# EAGLE schematic ECU_JUMPER (EAGLE 9.1.3)
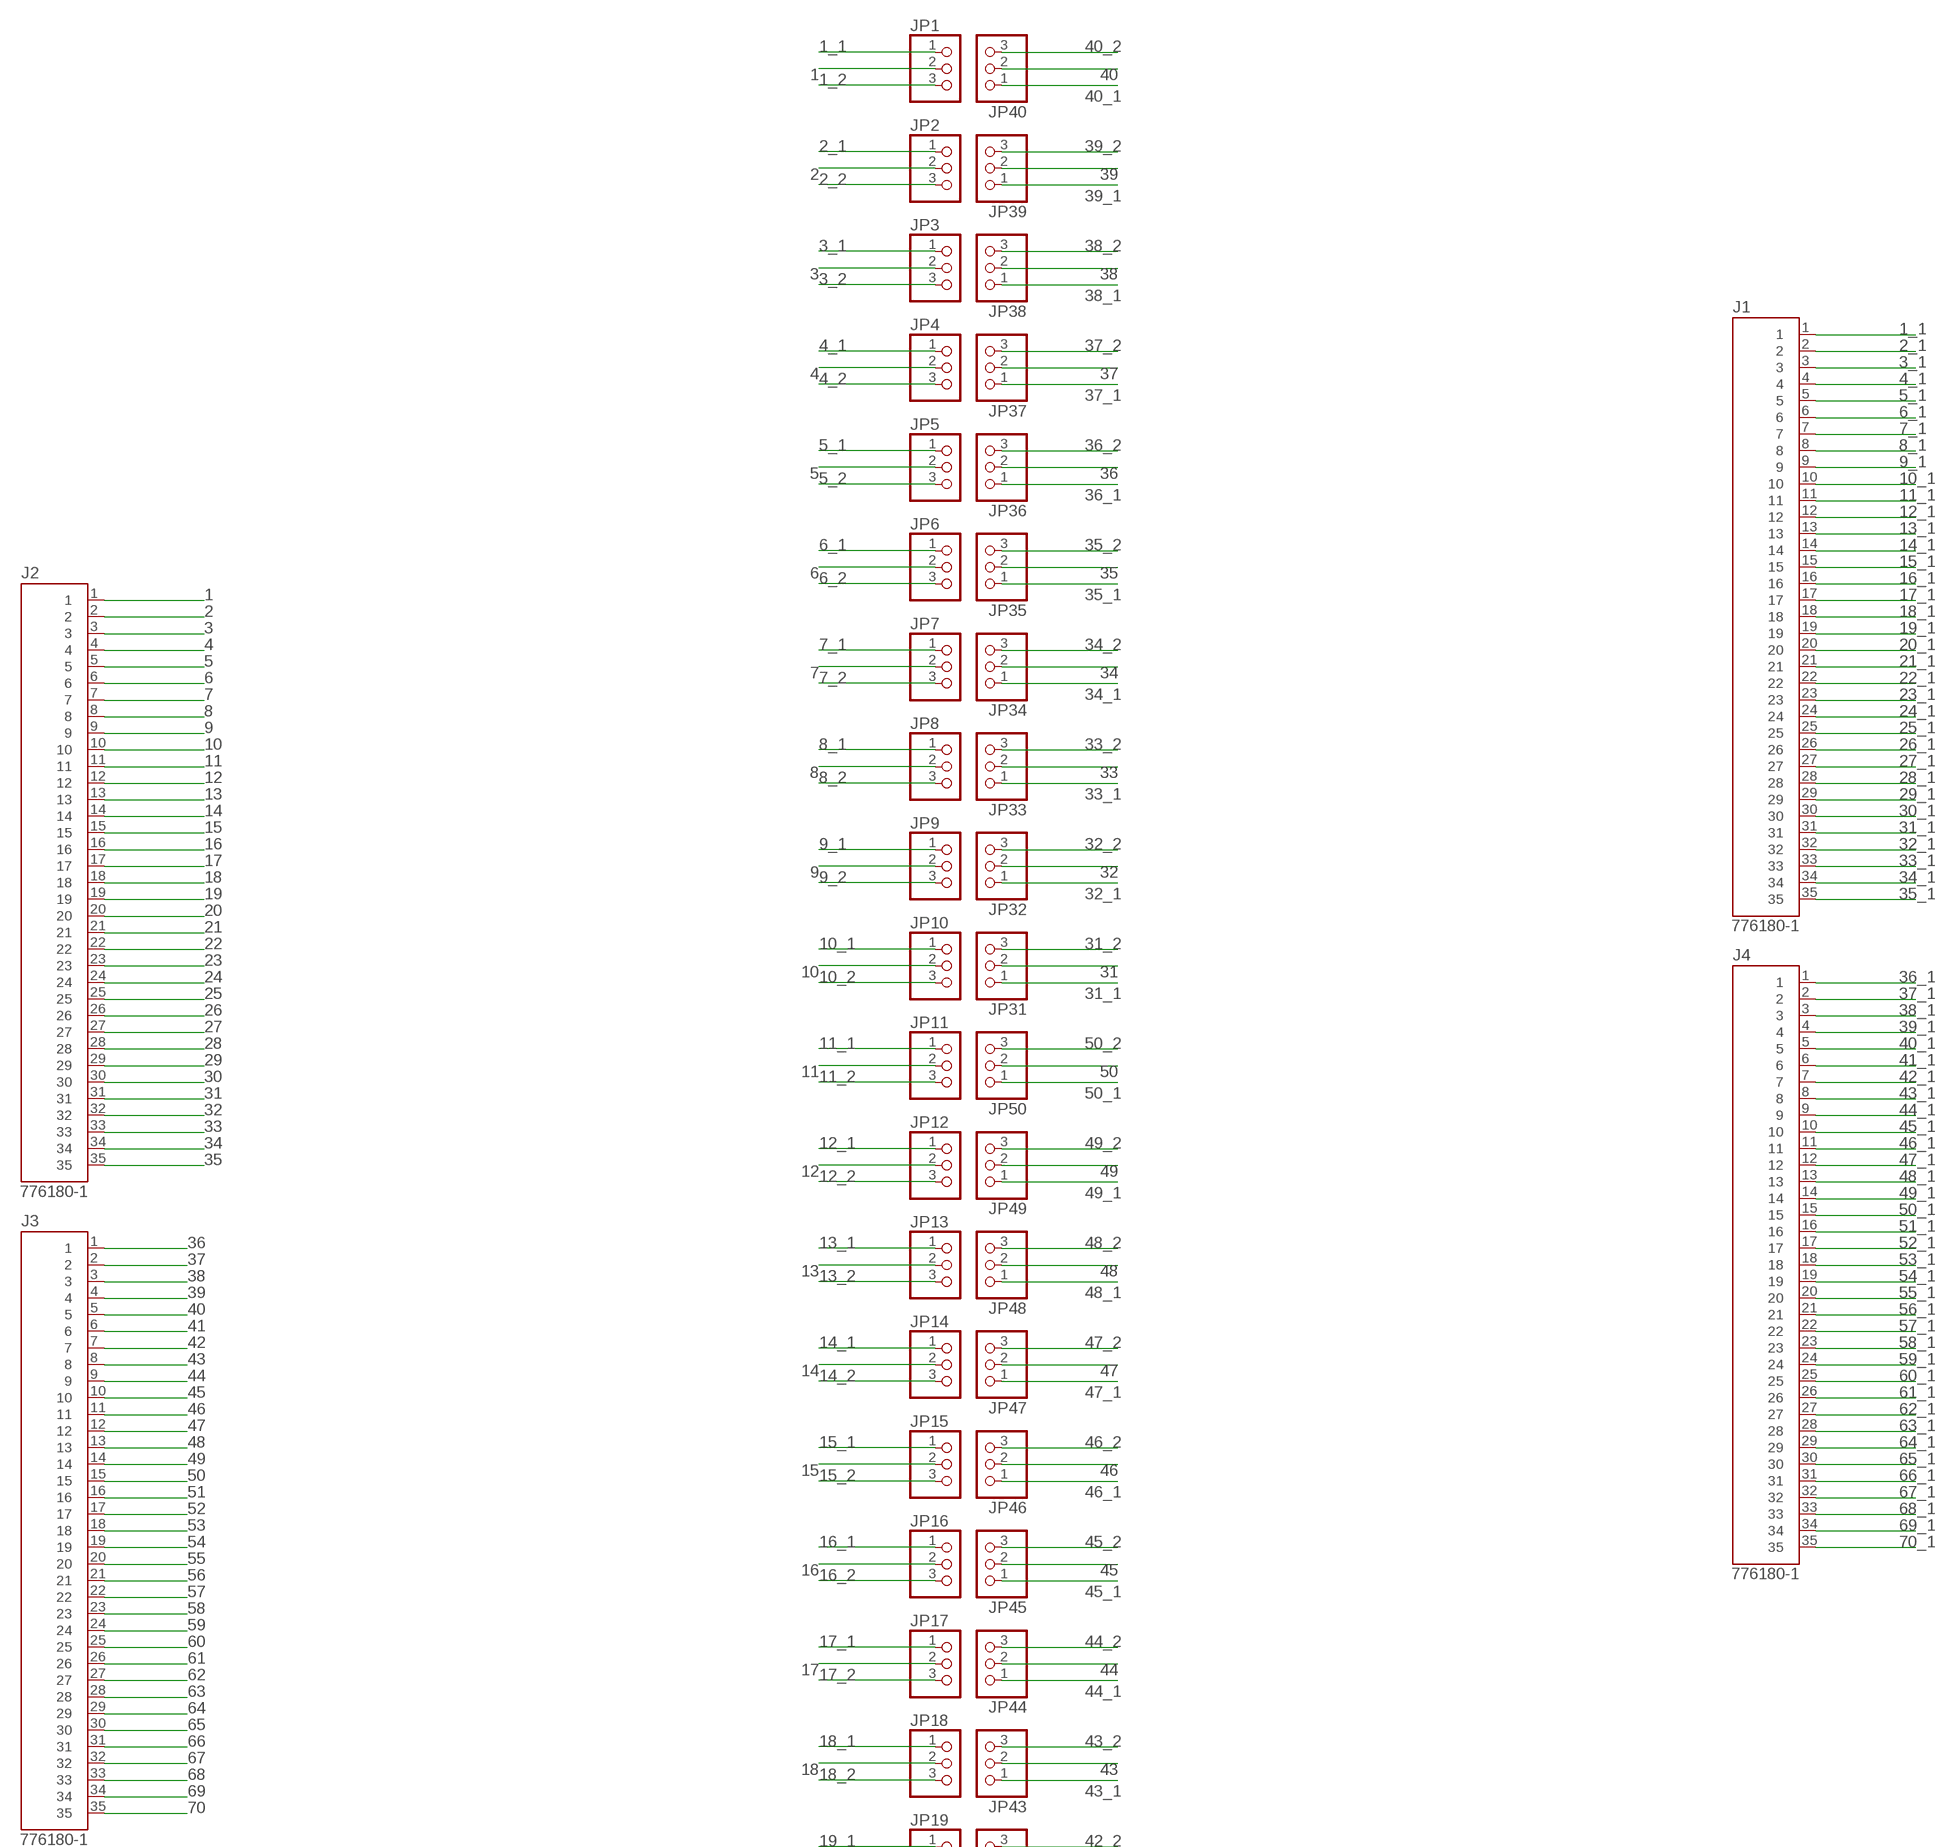
[diagram p0: schematic, sheet 1, part 1 of 2]
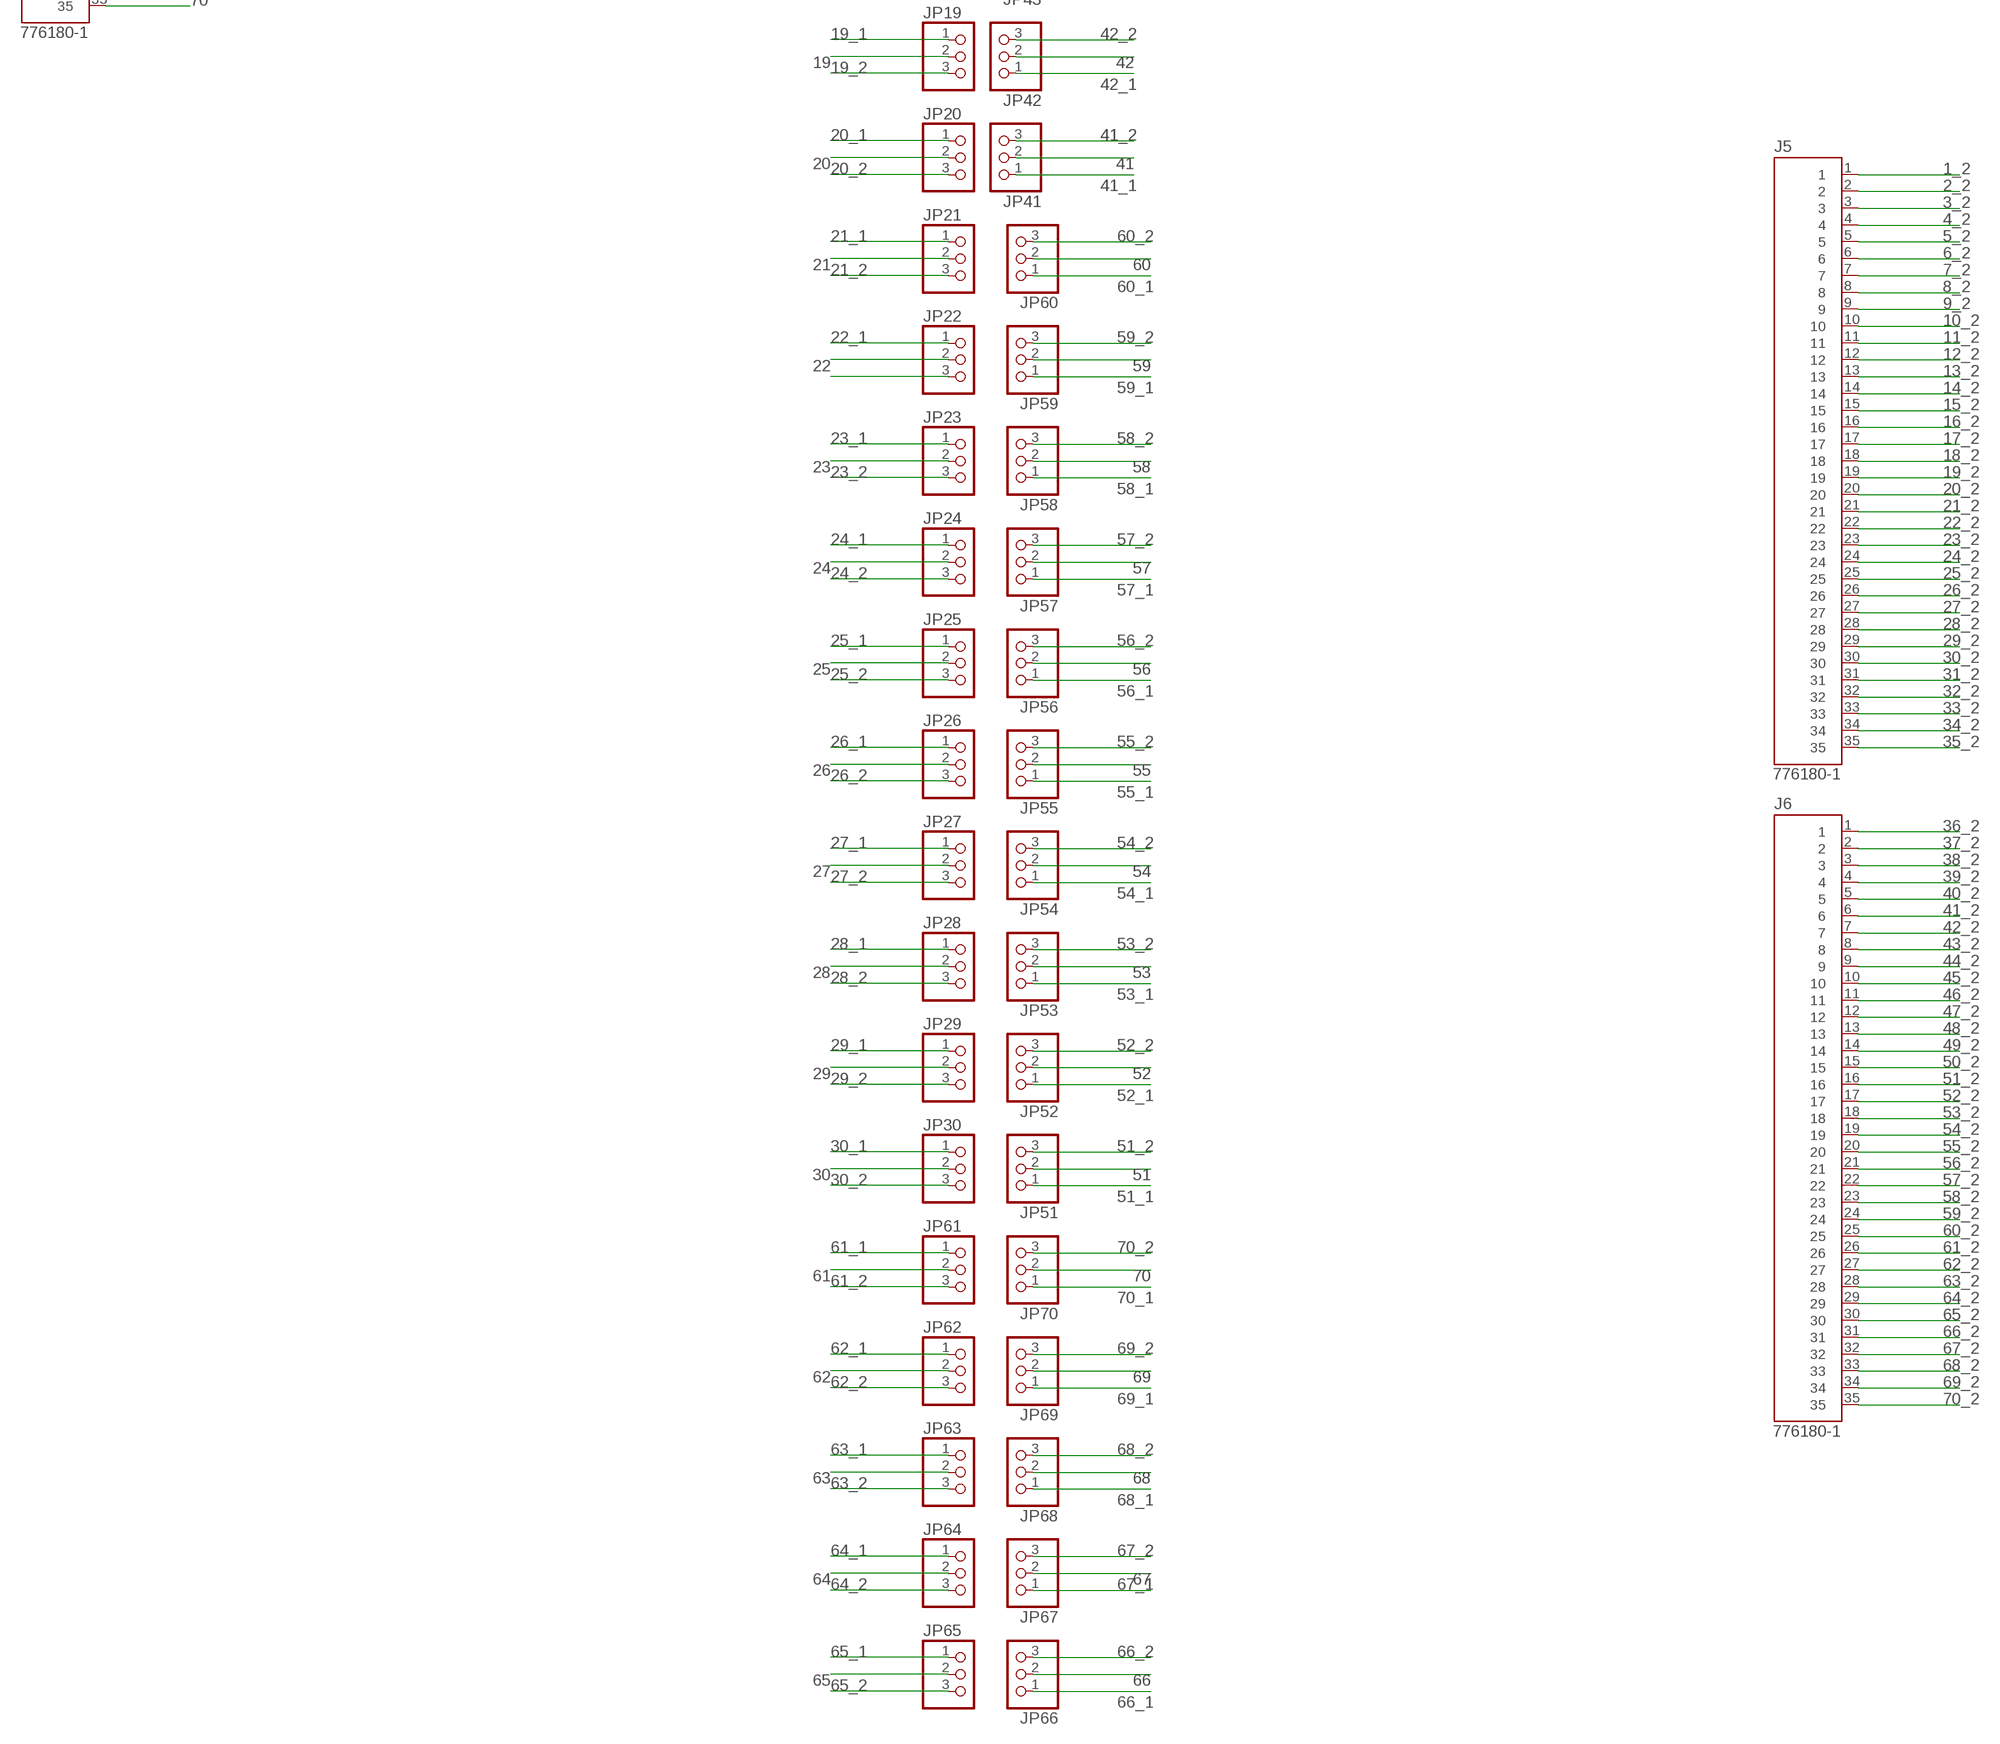
[diagram p1: schematic, sheet 1, part 2 of 2]

## Parts
J1  776180-1  [TE_776180-1]
J2  776180-1  [TE_776180-1]
J3  776180-1  [TE_776180-1]
J4  776180-1  [TE_776180-1]
J5  776180-1  [TE_776180-1]
J6  776180-1  [TE_776180-1]
JP1  PINHD-1X3  [1X03]
JP2  PINHD-1X3  [1X03]
JP3  PINHD-1X3  [1X03]
JP4  PINHD-1X3  [1X03]
JP5  PINHD-1X3  [1X03]
JP6  PINHD-1X3  [1X03]
JP7  PINHD-1X3  [1X03]
JP8  PINHD-1X3  [1X03]
JP9  PINHD-1X3  [1X03]
JP10  PINHD-1X3  [1X03]
JP11  PINHD-1X3  [1X03]
JP12  PINHD-1X3  [1X03]
JP13  PINHD-1X3  [1X03]
JP14  PINHD-1X3  [1X03]
JP15  PINHD-1X3  [1X03]
JP16  PINHD-1X3  [1X03]
JP17  PINHD-1X3  [1X03]
JP18  PINHD-1X3  [1X03]
JP19  PINHD-1X3  [1X03]
JP20  PINHD-1X3  [1X03]
JP21  PINHD-1X3  [1X03]
JP22  PINHD-1X3  [1X03]
JP23  PINHD-1X3  [1X03]
JP24  PINHD-1X3  [1X03]
JP25  PINHD-1X3  [1X03]
JP26  PINHD-1X3  [1X03]
JP27  PINHD-1X3  [1X03]
JP28  PINHD-1X3  [1X03]
JP29  PINHD-1X3  [1X03]
JP30  PINHD-1X3  [1X03]
JP31  PINHD-1X3  [1X03]
JP32  PINHD-1X3  [1X03]
JP33  PINHD-1X3  [1X03]
JP34  PINHD-1X3  [1X03]
JP35  PINHD-1X3  [1X03]
JP36  PINHD-1X3  [1X03]
JP37  PINHD-1X3  [1X03]
JP38  PINHD-1X3  [1X03]
JP39  PINHD-1X3  [1X03]
JP40  PINHD-1X3  [1X03]
JP41  PINHD-1X3  [1X03]
JP42  PINHD-1X3  [1X03]
JP43  PINHD-1X3  [1X03]
JP44  PINHD-1X3  [1X03]
JP45  PINHD-1X3  [1X03]
JP46  PINHD-1X3  [1X03]
JP47  PINHD-1X3  [1X03]
JP48  PINHD-1X3  [1X03]
JP49  PINHD-1X3  [1X03]
JP50  PINHD-1X3  [1X03]
JP51  PINHD-1X3  [1X03]
JP52  PINHD-1X3  [1X03]
JP53  PINHD-1X3  [1X03]
JP54  PINHD-1X3  [1X03]
JP55  PINHD-1X3  [1X03]
JP56  PINHD-1X3  [1X03]
JP57  PINHD-1X3  [1X03]
JP58  PINHD-1X3  [1X03]
JP59  PINHD-1X3  [1X03]
JP60  PINHD-1X3  [1X03]
JP61  PINHD-1X3  [1X03]
JP62  PINHD-1X3  [1X03]
JP63  PINHD-1X3  [1X03]
JP64  PINHD-1X3  [1X03]
JP65  PINHD-1X3  [1X03]
JP66  PINHD-1X3  [1X03]
JP67  PINHD-1X3  [1X03]
JP68  PINHD-1X3  [1X03]
JP69  PINHD-1X3  [1X03]
JP70  PINHD-1X3  [1X03]

## Nets
1: J2.1 JP1.2
1_1: J1.1 JP1.1
1_2: J5.1 JP1.3
2: J2.2 JP2.2
2_1: J1.2 JP2.1
2_2: J5.2 JP2.3
3: J2.3 JP3.2
3_1: J1.3 JP3.1
3_2: J5.3 JP3.3
4: J2.4 JP4.2
4_1: J1.4 JP4.1
4_2: J5.4 JP4.3
5: J2.5 JP5.2
5_1: J1.5 JP5.1
5_2: J5.5 JP5.3
6: J2.6 JP6.2
6_1: J1.6 JP6.1
6_2: J5.6 JP6.3
7: J2.7 JP7.2
7_1: J1.7 JP7.1
7_2: J5.7 JP7.3
8: J2.8 JP8.2
8_1: J1.8 JP8.1
8_2: J5.8 JP8.3
9: J2.9 JP9.2
9_1: J1.9 JP9.1
9_2: J5.9 JP9.3
10: J2.10 JP10.2
10_1: J1.10 JP10.1
10_2: J5.10 JP10.3
11: J2.11 JP11.2
11_1: J1.11 JP11.1
11_2: J5.11 JP11.3
12: J2.12 JP12.2
12_1: J1.12 JP12.1
12_2: J5.12 JP12.3
13: J2.13 JP13.2
13_1: J1.13 JP13.1
13_2: J5.13 JP13.3
14: J2.14 JP14.2
14_1: J1.14 JP14.1
14_2: J5.14 JP14.3
15: J2.15 JP15.2
15_1: J1.15 JP15.1
15_2: J5.15 JP15.3
16: J2.16 JP16.2
16_1: J1.16 JP16.1
16_2: J5.16 JP16.3
17: J2.17 JP17.2
17_1: J1.17 JP17.1
17_2: J5.17 JP17.3
18: J2.18 JP18.2
18_1: J1.18 JP18.1
18_2: J5.18 JP18.3
19: J2.19 JP19.2
19_1: J1.19 JP19.1
19_2: J5.19 JP19.3
20: J2.20 JP20.2
20_1: J1.20 JP20.1
20_2: J5.20 JP20.3
21: J2.21 JP21.2
21_1: J1.21 JP21.1
21_2: J5.21 JP21.3
22: J2.22 JP22.2
22_1: J1.22 JP22.1
22_2: J5.22
23: J2.23 JP23.2
23_1: J1.23 JP23.1
23_2: J5.23 JP23.3
24: J2.24 JP24.2
24_1: J1.24 JP24.1
24_2: J5.24 JP24.3
25: J2.25 JP25.2
25_1: J1.25 JP25.1
25_2: J5.25 JP25.3
26: J2.26 JP26.2
26_1: J1.26 JP26.1
26_2: J5.26 JP26.3
27: J2.27 JP27.2
27_1: J1.27 JP27.1
27_2: J5.27 JP27.3
28: J2.28 JP28.2
28_1: J1.28 JP28.1
28_2: J5.28 JP28.3
29: J2.29 JP29.2
29_1: J1.29 JP29.1
29_2: J5.29 JP29.3
30: J2.30 JP30.2
30_1: J1.30 JP30.1
30_2: J5.30 JP30.3
31: J2.31 JP31.2
31_1: J1.31 JP31.1
31_2: J5.31 JP31.3
32: J2.32 JP32.2
32_1: J1.32 JP32.1
32_2: J5.32 JP32.3
33: J2.33 JP33.2
33_1: J1.33 JP33.1
33_2: J5.33 JP33.3
34: J2.34 JP34.2
34_1: J1.34 JP34.1
34_2: J5.34 JP34.3
35: J2.35 JP35.2
35_1: J1.35 JP35.1
35_2: J5.35 JP35.3
36: J3.1 JP36.2
36_1: J4.1 JP36.1
36_2: J6.1 JP36.3
37: J3.2 JP37.2
37_1: J4.2 JP37.1
37_2: J6.2 JP37.3
38: J3.3 JP38.2
38_1: J4.3 JP38.1
38_2: J6.3 JP38.3
39: J3.4 JP39.2
39_1: J4.4 JP39.1
39_2: J6.4 JP39.3
40: J3.5 JP40.2
40_1: J4.5 JP40.1
40_2: J6.5 JP40.3
41: J3.6 JP41.2
41_1: J4.6 JP41.1
41_2: J6.6 JP41.3
42: J3.7 JP42.2
42_1: J4.7 JP42.1
42_2: J6.7 JP42.3
43: J3.8 JP43.2
43_1: J4.8 JP43.1
43_2: J6.8 JP43.3
44: J3.9 JP44.2
44_1: J4.9 JP44.1
44_2: J6.9 JP44.3
45: J3.10 JP45.2
45_1: J4.10 JP45.1
45_2: J6.10 JP45.3
46: J3.11 JP46.2
46_1: J4.11 JP46.1
46_2: J6.11 JP46.3
47: J3.12 JP47.2
47_1: J4.12 JP47.1
47_2: J6.12 JP47.3
48: J3.13 JP48.2
48_1: J4.13 JP48.1
48_2: J6.13 JP48.3
49: J3.14 JP49.2
49_1: J4.14 JP49.1
49_2: J6.14 JP49.3
50: J3.15 JP50.2
50_1: J4.15 JP50.1
50_2: J6.15 JP50.3
51: J3.16 JP51.2
51_1: J4.16 JP51.1
51_2: J6.16 JP51.3
52: J3.17 JP52.2
52_1: J4.17 JP52.1
52_2: J6.17 JP52.3
53: J3.18 JP53.2
53_1: J4.18 JP53.1
53_2: J6.18 JP53.3
54: J3.19 JP54.2
54_1: J4.19 JP54.1
54_2: J6.19 JP54.3
55: J3.20 JP55.2
55_1: J4.20 JP55.1
55_2: J6.20 JP55.3
56: J3.21 JP56.2
56_1: J4.21 JP56.1
56_2: J6.21 JP56.3
57: J3.22 JP57.2
57_1: J4.22 JP57.1
57_2: J6.22 JP57.3
58: J3.23 JP58.2
58_1: J4.23 JP58.1
58_2: J6.23 JP58.3
59: J3.24 JP59.2
59_1: J4.24 JP59.1
59_2: J6.24 JP59.3
60: J3.25 JP60.2
60_1: J4.25 JP60.1
60_2: J6.25 JP60.3
61: J3.26 JP61.2
61_1: J4.26 JP61.1
61_2: J6.26 JP61.3
62: J3.27 JP62.2
62_1: J4.27 JP62.1
62_2: J6.27 JP62.3
63: J3.28 JP63.2
63_1: J4.28 JP63.1
63_2: J6.28 JP63.3
64: J3.29 JP64.2
64_1: J4.29 JP64.1
64_2: J6.29 JP64.3
65: J3.30 JP65.2
65_1: J4.30 JP65.1
65_2: J6.30 JP65.3
66: J3.31 JP66.2
66_1: J4.31 JP66.1
66_2: J6.31 JP66.3
67: J3.32 JP67.2
67_1: J4.32 JP67.1
67_2: J6.32 JP67.3
68: J3.33 JP68.2
68_1: J4.33 JP68.1
68_2: J6.33 JP68.3
69: J3.34 JP69.2
69_1: J4.34 JP69.1
69_2: J6.34 JP69.3
70: J3.35 JP70.2
70_1: J4.35 JP70.1
70_2: J6.35 JP70.3
N$66: JP22.3

## Library data of the parts
J1-J6 = 776180-1:776180-1: Conn Rectangular HDR 35 POS Solder RA Thru-Hole Automotive; MANUFACTURER: TE CONNECTIVITY; PARTREV: H7; STANDARD: STANDARED RECOMENDATION
JP1-JP70 = pinhead:PINHD-1X3: PIN HEADER